# Altium schematic sheet LED Matrix.SchDoc
size Letter; DrawnBy: Tony Liu, Kyle Hong; Revision: 1; SheetNumber: 1; SheetTotal: 1
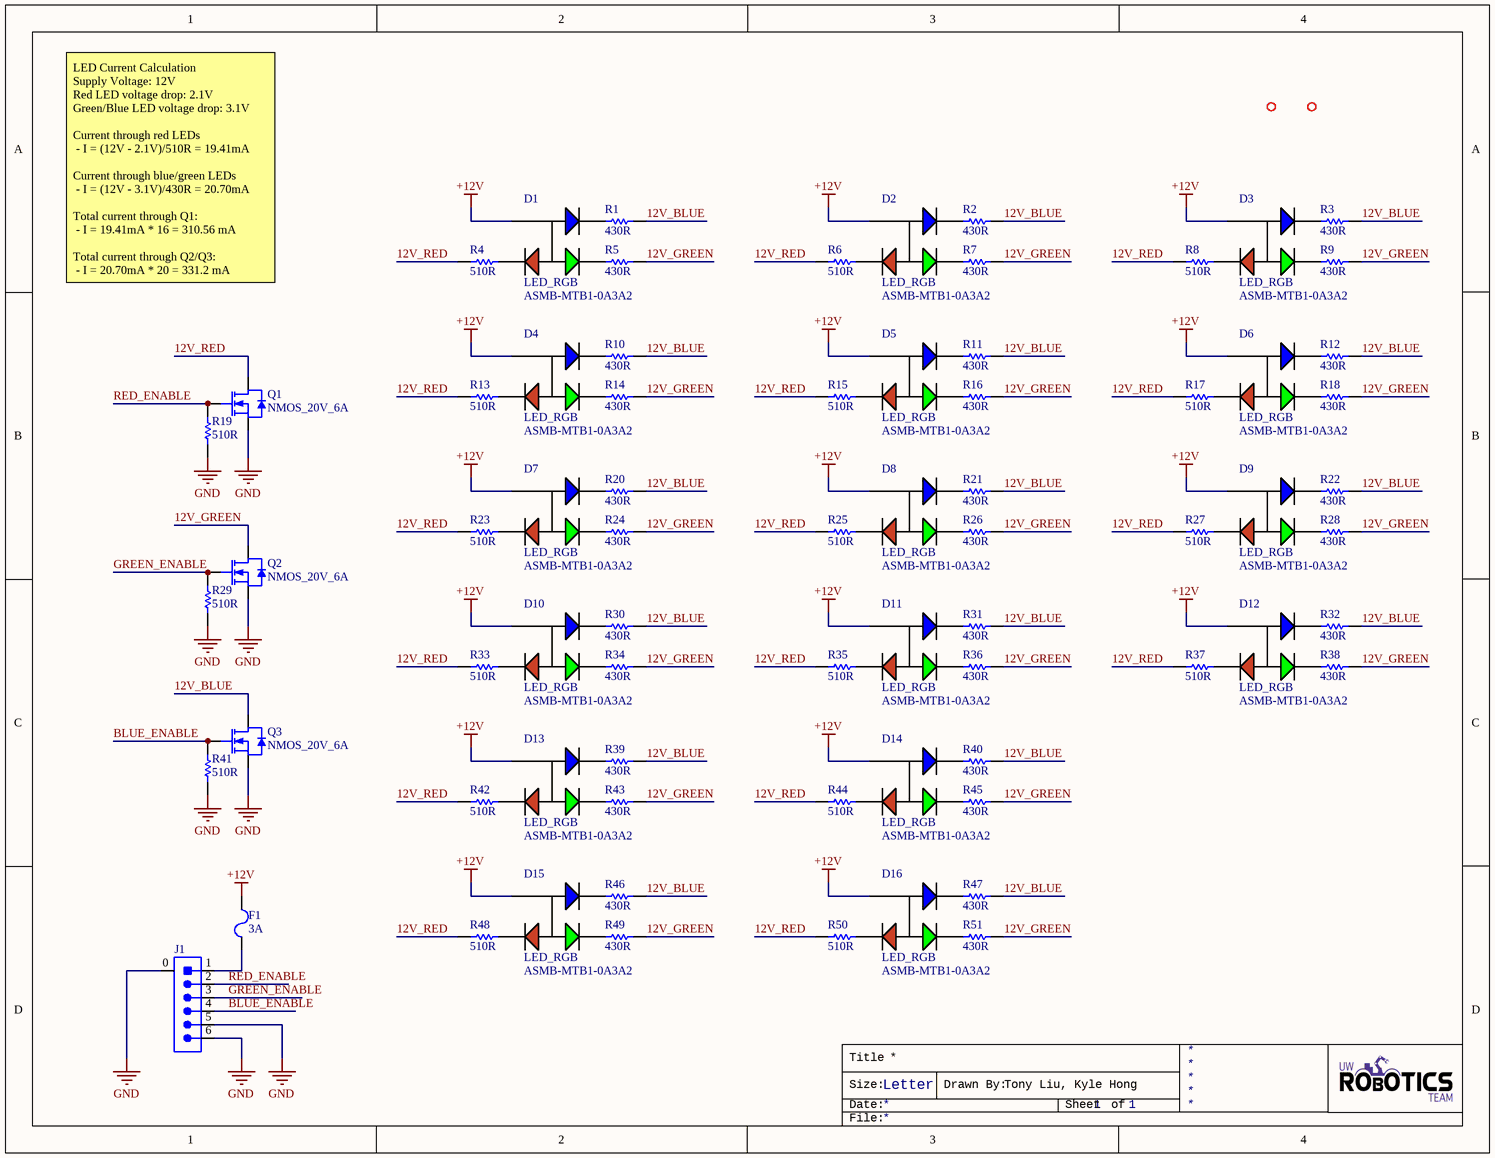
[diagram p0: LED Matrix.SchDoc]

## Parts
D1  LED_RGB  Manufacturer Part Number 1: ASMB-MTB1-0A3A2  [LED_RGB]
D2  LED_RGB  Manufacturer Part Number 1: ASMB-MTB1-0A3A2  [LED_RGB]
D3  LED_RGB  Manufacturer Part Number 1: ASMB-MTB1-0A3A2  [LED_RGB]
D4  LED_RGB  Manufacturer Part Number 1: ASMB-MTB1-0A3A2  [LED_RGB]
D5  LED_RGB  Manufacturer Part Number 1: ASMB-MTB1-0A3A2  [LED_RGB]
D6  LED_RGB  Manufacturer Part Number 1: ASMB-MTB1-0A3A2  [LED_RGB]
D7  LED_RGB  Manufacturer Part Number 1: ASMB-MTB1-0A3A2  [LED_RGB]
D8  LED_RGB  Manufacturer Part Number 1: ASMB-MTB1-0A3A2  [LED_RGB]
D9  LED_RGB  Manufacturer Part Number 1: ASMB-MTB1-0A3A2  [LED_RGB]
D10  LED_RGB  Manufacturer Part Number 1: ASMB-MTB1-0A3A2  [LED_RGB]
D11  LED_RGB  Manufacturer Part Number 1: ASMB-MTB1-0A3A2  [LED_RGB]
D12  LED_RGB  Manufacturer Part Number 1: ASMB-MTB1-0A3A2  [LED_RGB]
D13  LED_RGB  Manufacturer Part Number 1: ASMB-MTB1-0A3A2  [LED_RGB]
D14  LED_RGB  Manufacturer Part Number 1: ASMB-MTB1-0A3A2  [LED_RGB]
D15  LED_RGB  Manufacturer Part Number 1: ASMB-MTB1-0A3A2  [LED_RGB]
D16  LED_RGB  Manufacturer Part Number 1: ASMB-MTB1-0A3A2  [LED_RGB]
F1  Current Rating: 3A  [FUSE_1206]  (hidden comment: FUSE_3A_1206)
J1  CON_6M_SM_RA  [MOLEX-5024940670]  (value not drawn)
MH1  MOUNTING_HOLES  [MOUNTING_HOLE]  (value not drawn)
MH2  MOUNTING_HOLES  [MOUNTING_HOLE]  (value not drawn)
Q1  NMOS_20V_6A  [NMOS_SOT23-3]
Q2  NMOS_20V_6A  [NMOS_SOT23-3]
Q3  NMOS_20V_6A  [NMOS_SOT23-3]
R1  value 430R  [RESC2012X60N]  (hidden comment: RES_430R_0805)
R2  value 430R  [RESC2012X60N]  (hidden comment: RES_430R_0805)
R3  value 430R  [RESC2012X60N]  (hidden comment: RES_430R_0805)
R4  value 510R  [RESC2012X60N]  (hidden comment: RES_510R_0805)
R5  value 430R  [RESC2012X60N]  (hidden comment: RES_430R_0805)
R6  value 510R  [RESC2012X60N]  (hidden comment: RES_510R_0805)
R7  value 430R  [RESC2012X60N]  (hidden comment: RES_430R_0805)
R8  value 510R  [RESC2012X60N]  (hidden comment: RES_510R_0805)
R9  value 430R  [RESC2012X60N]  (hidden comment: RES_430R_0805)
R10  value 430R  [RESC2012X60N]  (hidden comment: RES_430R_0805)
R11  value 430R  [RESC2012X60N]  (hidden comment: RES_430R_0805)
R12  value 430R  [RESC2012X60N]  (hidden comment: RES_430R_0805)
R13  value 510R  [RESC2012X60N]  (hidden comment: RES_510R_0805)
R14  value 430R  [RESC2012X60N]  (hidden comment: RES_430R_0805)
R15  value 510R  [RESC2012X60N]  (hidden comment: RES_510R_0805)
R16  value 430R  [RESC2012X60N]  (hidden comment: RES_430R_0805)
R17  value 510R  [RESC2012X60N]  (hidden comment: RES_510R_0805)
R18  value 430R  [RESC2012X60N]  (hidden comment: RES_430R_0805)
R19  value 510R  [RESC2012X60N]  (hidden comment: RES_510R_0805)
R20  value 430R  [RESC2012X60N]  (hidden comment: RES_430R_0805)
R21  value 430R  [RESC2012X60N]  (hidden comment: RES_430R_0805)
R22  value 430R  [RESC2012X60N]  (hidden comment: RES_430R_0805)
R23  value 510R  [RESC2012X60N]  (hidden comment: RES_510R_0805)
R24  value 430R  [RESC2012X60N]  (hidden comment: RES_430R_0805)
R25  value 510R  [RESC2012X60N]  (hidden comment: RES_510R_0805)
R26  value 430R  [RESC2012X60N]  (hidden comment: RES_430R_0805)
R27  value 510R  [RESC2012X60N]  (hidden comment: RES_510R_0805)
R28  value 430R  [RESC2012X60N]  (hidden comment: RES_430R_0805)
R29  value 510R  [RESC2012X60N]  (hidden comment: RES_510R_0805)
R30  value 430R  [RESC2012X60N]  (hidden comment: RES_430R_0805)
R31  value 430R  [RESC2012X60N]  (hidden comment: RES_430R_0805)
R32  value 430R  [RESC2012X60N]  (hidden comment: RES_430R_0805)
R33  value 510R  [RESC2012X60N]  (hidden comment: RES_510R_0805)
R34  value 430R  [RESC2012X60N]  (hidden comment: RES_430R_0805)
R35  value 510R  [RESC2012X60N]  (hidden comment: RES_510R_0805)
R36  value 430R  [RESC2012X60N]  (hidden comment: RES_430R_0805)
R37  value 510R  [RESC2012X60N]  (hidden comment: RES_510R_0805)
R38  value 430R  [RESC2012X60N]  (hidden comment: RES_430R_0805)
R39  value 430R  [RESC2012X60N]  (hidden comment: RES_430R_0805)
R40  value 430R  [RESC2012X60N]  (hidden comment: RES_430R_0805)
R41  value 510R  [RESC2012X60N]  (hidden comment: RES_510R_0805)
R42  value 510R  [RESC2012X60N]  (hidden comment: RES_510R_0805)
R43  value 430R  [RESC2012X60N]  (hidden comment: RES_430R_0805)
R44  value 510R  [RESC2012X60N]  (hidden comment: RES_510R_0805)
R45  value 430R  [RESC2012X60N]  (hidden comment: RES_430R_0805)
R46  value 430R  [RESC2012X60N]  (hidden comment: RES_430R_0805)
R47  value 430R  [RESC2012X60N]  (hidden comment: RES_430R_0805)
R48  value 510R  [RESC2012X60N]  (hidden comment: RES_510R_0805)
R49  value 430R  [RESC2012X60N]  (hidden comment: RES_430R_0805)
R50  value 510R  [RESC2012X60N]  (hidden comment: RES_510R_0805)
R51  value 430R  [RESC2012X60N]  (hidden comment: RES_430R_0805)

## Nets
+12V: D1.4 D2.4 D3.4 D4.4 D5.4 D6.4 D7.4 D8.4 D9.4 D10.4 D11.4 D12.4 D13.4 D14.4 D15.4 D16.4 F1.2
GND: J1.0 J1.5 J1.6 Q1.2(S) Q2.2(S) Q3.2(S) R19.1 R29.1 R41.1
12V_BLUE: Q3.3(D) R1.1 R2.1 R3.1 R10.1 R11.1 R12.1 R20.1 R21.1 R22.1 R30.1 R31.1 R32.1 R39.1 R40.1 R46.1 R47.1
12V_GREEN: Q2.3(D) R5.1 R7.1 R9.1 R14.1 R16.1 R18.1 R24.1 R26.1 R28.1 R34.1 R36.1 R38.1 R43.1 R45.1 R49.1 R51.1
12V_RED: Q1.3(D) R4.2 R6.2 R8.2 R13.2 R15.2 R17.2 R23.2 R25.2 R27.2 R33.2 R35.2 R37.2 R42.2 R44.2 R48.2 R50.2
BLUE_ENABLE: J1.4 Q3.1(G) R41.2
GREEN_ENABLE: J1.3 Q2.1(G) R29.2
RED_ENABLE: J1.2 Q1.1(G) R19.2
NetD1_1: D1.1 R4.1
NetD1_2: D1.2 R5.2
NetD1_3: D1.3 R1.2
NetD2_1: D2.1 R6.1
NetD2_2: D2.2 R7.2
NetD2_3: D2.3 R2.2
NetD3_1: D3.1 R8.1
NetD3_2: D3.2 R9.2
NetD3_3: D3.3 R3.2
NetD4_1: D4.1 R13.1
NetD4_2: D4.2 R14.2
NetD4_3: D4.3 R10.2
NetD5_1: D5.1 R15.1
NetD5_2: D5.2 R16.2
NetD5_3: D5.3 R11.2
NetD6_1: D6.1 R17.1
NetD6_2: D6.2 R18.2
NetD6_3: D6.3 R12.2
NetD7_1: D7.1 R23.1
NetD7_2: D7.2 R24.2
NetD7_3: D7.3 R20.2
NetD8_1: D8.1 R25.1
NetD8_2: D8.2 R26.2
NetD8_3: D8.3 R21.2
NetD9_1: D9.1 R27.1
NetD9_2: D9.2 R28.2
NetD9_3: D9.3 R22.2
NetD10_1: D10.1 R33.1
NetD10_2: D10.2 R34.2
NetD10_3: D10.3 R30.2
NetD11_1: D11.1 R35.1
NetD11_2: D11.2 R36.2
NetD11_3: D11.3 R31.2
NetD12_1: D12.1 R37.1
NetD12_2: D12.2 R38.2
NetD12_3: D12.3 R32.2
NetD13_1: D13.1 R42.1
NetD13_2: D13.2 R43.2
NetD13_3: D13.3 R39.2
NetD14_1: D14.1 R44.1
NetD14_2: D14.2 R45.2
NetD14_3: D14.3 R40.2
NetD15_1: D15.1 R48.1
NetD15_2: D15.2 R49.2
NetD15_3: D15.3 R46.2
NetD16_1: D16.1 R50.1
NetD16_2: D16.2 R51.2
NetD16_3: D16.3 R47.2
NetF1_1: F1.1 J1.1

## Notes on the sheet
- LED Current Calculation
  Supply Voltage: 12V
  Red LED voltage drop: 2.1V
  Green/Blue LED voltage drop: 3.1V
  Current through red LEDs
  - I = (12V - 2.1V)/510R = 19.41mA
  Current through blue/green LEDs
  - I = (12V - 3.1V)/430R = 20.70mA
  Total current through Q1:
  - I = 19.41mA * 16 = 310.56 mA
  Total current through Q2/Q3:
  - I = 20.70mA * 20 = 331.2 mA
- Title
- Size:
- Date:
- Letter
- Drawn By:
- Sheet
- of
- File:

## Library data of the parts
D1-D16 = LED_RGB: LED RGB DIFFUSED 4PLCC SMD; Manufacturer 1: Broadcom; Color: Blue,Green,Red; Lens Color: White; Viewing Angle: 115°; Lens Style: Round; Luminous Intensity: 350mcd; Dominant Wavelength: 470nm; Forward Voltage: 3.1V; Test Current: 20mA; Supplier 1: Digi-Key; Stock 1: 142531; Pricing 1: 1=0.60000, 10=0.47100, 100=0.30210, 500=0.25980, 1000=0.20059 (USD); RoHS: Yes; Mount: Surface Mount; Case/Package: PLCC; Number of Pins: 4; Packaging: Cut Tape; Lens Transparency: Diffused; Length: 3.2mm; Height: 1.9mm; Width: 2.8mm; REACH SVHC: No SVHC; ComponentLink1URL: http://www.farnell.com/datasheets/2111106.pdf?src-supplier=Farnell; ComponentLink1Description: http://www.farnell.com/datasheets/2111106.pdf?src-supplier=Farnell; ComponentLink2URL: https://docs.broadcom.com/docs/AV02-4194EN?src-supplier=Digi-Key; ComponentLink2Description: https://docs.broadcom.com/docs/AV02-4194EN?src-supplier=Digi-Key; ComponentLink3URL: http://www.farnell.com/datasheets/1801564.pdf?src-supplier=Element14; ComponentLink3Description: http://www.farnell.com/datasheets/1801564.pdf?src-supplier=Element14; ComponentLink4URL: http://www.farnell.com/datasheets/2111106.pdf?src-supplier=Newark; ComponentLink4Description: http://www.farnell.com/datasheets/2111106.pdf?src-supplier=Newark; Supplier Part Number 1: 516-3280-1-ND
F1 = FUSE_3A_1206: FUSE BOARD MNT 3A 32VAC/VDC 1206; Manufacturer 1: Littelfuse; Manufacturer Part Number 1: 0466003.NR; Voltage Rating (AC): 32V; DC Cold Resistance: 0.02R; Power Dissipation: 228mW; Fuse Type: Board Mount (Cartridge Style Excluded); Approvals: UL,CSA; Response Time: Fast Blow; Supplier 1: Digi-Key; Stock 1: 10729; Pricing 1: 1=1.20000, 5=1.16600, 10=1.09100, 50=0.90280, 100=0.75240, 250=0.73360, 500=0.62074, 1000=0.54549 (USD); RoHS: Yes; Mount: Surface Mount; Case/Package: 1206; Number of Pins: 2; Case Code (Metric): 3216; Case Code (Imperial): 1206; Min Operating Temperature: -55°C; Max Operating Temperature: 90°C; Voltage Rating (DC): 32V; Packaging: Cut Tape; Package Quantity: 5000; Composition: Thin Film; Resistance: 0.02R; Fuse Current: 3A; Working Voltage: 32V; Length: 3.18mm; Height: 0.023inch; Width: 1.52mm; Radiation Hardening: No; REACH SVHC: Unknown; Lead Free: Lead Free; Supplier Part Number 1: F1458CT-ND
J1 = CON_6M_SM_RA: CONN HEADER SMD RIGHT ANGLE 2MM PITCH; Manufacturer 1: Molex; Manufacturer Part Number 1: 502494-0670; Insulation Resistance: 1GR; Current Rating: 3A; Voltage Rating: 250V; Connector Type: Receptacle,Forked; Number of Positions: 6; Gender: Receptacle; Glow Wire Compliant: Non-compliant; Supplier 1: Digi-Key; Stock 1: 7093; Pricing 1: 1=0.81000, 10=0.70800, 25=0.66680, 50=0.63880, 100=0.61110, 250=0.55552 (USD); RoHS: Yes; Mount: Surface Mount; Material: Polybutylene; Color: Natural; Housing Material: PBT; Housing Color: Natural; Contact Plating: Tin; Contact Material: Copper Alloy; Min Operating Temperature: -25°C; Max Operating Temperature: 85°C; Package Quantity: 950; Number of Rows: 1; Fastening Type: Latch; Packaging: Tape and Reel; Termination: Solder; Number of Contacts: 6; Orientation: Right Angle; Number of Circuits: 6; Contact Gender: Female; Max Voltage Rating (AC): 250V; Max Voltage Rating (DC): 250V; Length: 16mm; Pitch: 2mm; Depth: 6.85mm; Radiation Hardening: No; REACH SVHC: Unknown; Flammability Rating: UL94 V-0; ComponentLink1URL: https://datasheet.ciiva.com/755/5024940670-sd-755844.pdf?src-supplier=Digi-Key; ComponentLink1Description: https://datasheet.ciiva.com/755/5024940670-sd-755844.pdf?src-supplier=Digi-Key; ComponentLink2URL: https://datasheet.ciiva.com/24467/101355024940670-pcb-receptacles-24467588.pdf?src-supplier=Onlinecomponents.com; ComponentLink2Description: https://datasheet.ciiva.com/24467/101355024940670-pcb-receptacles-24467588.pdf?src-supplier=Onlinecomponents.com; ComponentLink3URL: https://datasheet.ciiva.com/16656/5024940670-pcb-receptacles-16656439.pdf?src-supplier=Avnet+Europe; ComponentLink3Description: https://datasheet.ciiva.com/16656/5024940670-pcb-receptacles-16656439.pdf?src-supplier=Avnet+Europe; ComponentLink4URL: https://datasheet.ciiva.com/7436/1630854-7436283.pdf?src-supplier=Newark; ComponentLink4Description: https://datasheet.ciiva.com/7436/1630854-7436283.pdf?src-supplier=Newark; ComponentLink5URL: https://datasheet.ciiva.com/5157/5024940670-pcb-receptacles-179322-5157180.pdf?src-supplier=Mouser; ComponentLink5Description: https://datasheet.ciiva.com/5157/5024940670-pcb-receptacles-179322-5157180.pdf?src-supplier=Mouser; ComponentLink6URL: https://datasheet.ciiva.com/7917/1630854-7917014.pdf?src-supplier=Element14; ComponentLink6Description: https://datasheet.ciiva.com/7917/1630854-7917014.pdf?src-supplier=Element14; ComponentLink7URL: https://datasheet.ciiva.com/30242/101355024940670-pcb-receptacles-30242550.pdf?src-supplier=Onlinecomponents.com; ComponentLink7Description: https://datasheet.ciiva.com/30242/101355024940670-pcb-receptacles-30242550.pdf?src-supplier=Onlinecomponents.com; ComponentLink8URL: https://datasheet.ciiva.com/755/5024940670-sd-755789.pdf?src-supplier=Digi-Key; ComponentLink8Description: https://datasheet.ciiva.com/755/5024940670-sd-755789.pdf?src-supplier=Digi-Key; Supplier Part Number 1: WM2283CT-ND
MH1 MH2 = MOUNTING_HOLES: 6cm x 6cm
Q1-Q3 = NMOS_20V_6A: MOSFET N-CH 20V 6A SOT23; Manufacturer Part Number 1: AO3420; Manufacturer 1: Alpha & Omega; Package: TO-236-3, SC-59, SOT-23-3; ComponentLink1Description: Datasheet; ComponentLink1URL: http://aosmd.com/res/data_sheets/AO3420.pdf; Supplier 1: Digi-Key; Supplier Part Number 1: 785-1014-1-ND; Mount: Surface Mount
R1-R3 R5 R7 R9-R12 R14 R16 R18 R20-R22 R24 R26 R28 R30-R32 R34 R36 R38-R40 R43 R45-R47 R49 R51 = RES_430R_0805: RES SMD 430 OHM 1% 1/8W 0805; Manufacturer 1: Vishay Dale; Manufacturer Part Number 1: CRCW0805430RFKEA; Temperature Coefficient: 100ppm/°C; Power Rating: 125mW; Voltage Rating: 150V; Supplier 1: Digi-Key; Tolerance: 1%; Supplier Part Number 1: 541-430CCT-ND; Mount: Surface Mount; Stock 1: 2755291; Pricing 1: 1=0.10000, 10=0.03500, 100=0.01400, 1000=0.00631, 2500=0.00548 (USD); RoHS: Yes; Case/Package: Molded; Contact Plating: Tin,Lead,Matte; Case Code (Imperial): 0805; Case Code (Metric): 2012; Min Operating Temperature: -55°C; Max Operating Temperature: 155°C; Resistance: 430R; Packaging: Tape and Reel; Composition: Thick Film; Termination: SMD/SMT; Military Standard: Not; Length: 2mm; Depth: 1.25mm; Radiation Hardening: No; REACH SVHC: Unknown; Lead Free: Lead Free; ComponentLink1Description: Datasheet; ComponentLink1URL: http://www.vishay.com/docs/20035/dcrcwe3.pdf
R4 R6 R8 R13 R15 R17 R19 R23 R25 R27 R29 R33 R35 R37 R41 R42 R44 R48 R50 = RES_510R_0805: RES SMD 510 OHM 1% 1/8W 0805; Manufacturer 1: Vishay Dale; Manufacturer Part Number 1: CRCW0805510RFKEA; Temperature Coefficient: 100ppm/°C; Power Rating: 125mW; Voltage Rating: 150V; Supplier 1: Digi-Key; Stock 1: 2755291; Pricing 1: 1=0.10000, 10=0.03500, 100=0.01400, 1000=0.00631, 2500=0.00548 (USD); RoHS: Yes; Supplier Part Number 1: 541-510CCT-ND; Mount: Surface Mount; Case/Package: Molded; Contact Plating: Tin,Lead,Matte; Case Code (Imperial): 0805; Case Code (Metric): 2012; Min Operating Temperature: -55°C; Max Operating Temperature: 155°C; Resistance: 510R; Tolerance: 1%; Packaging: Tape and Reel; Composition: Thick Film; Termination: SMD/SMT; Military Standard: Not; Length: 2mm; Depth: 1.25mm; Radiation Hardening: No; REACH SVHC: Unknown; Lead Free: Lead Free; ComponentLink1Description: Datasheet; ComponentLink1URL: http://www.vishay.com/docs/20035/dcrcwe3.pdf